# Altium project qol56-pcb.PrjPcb
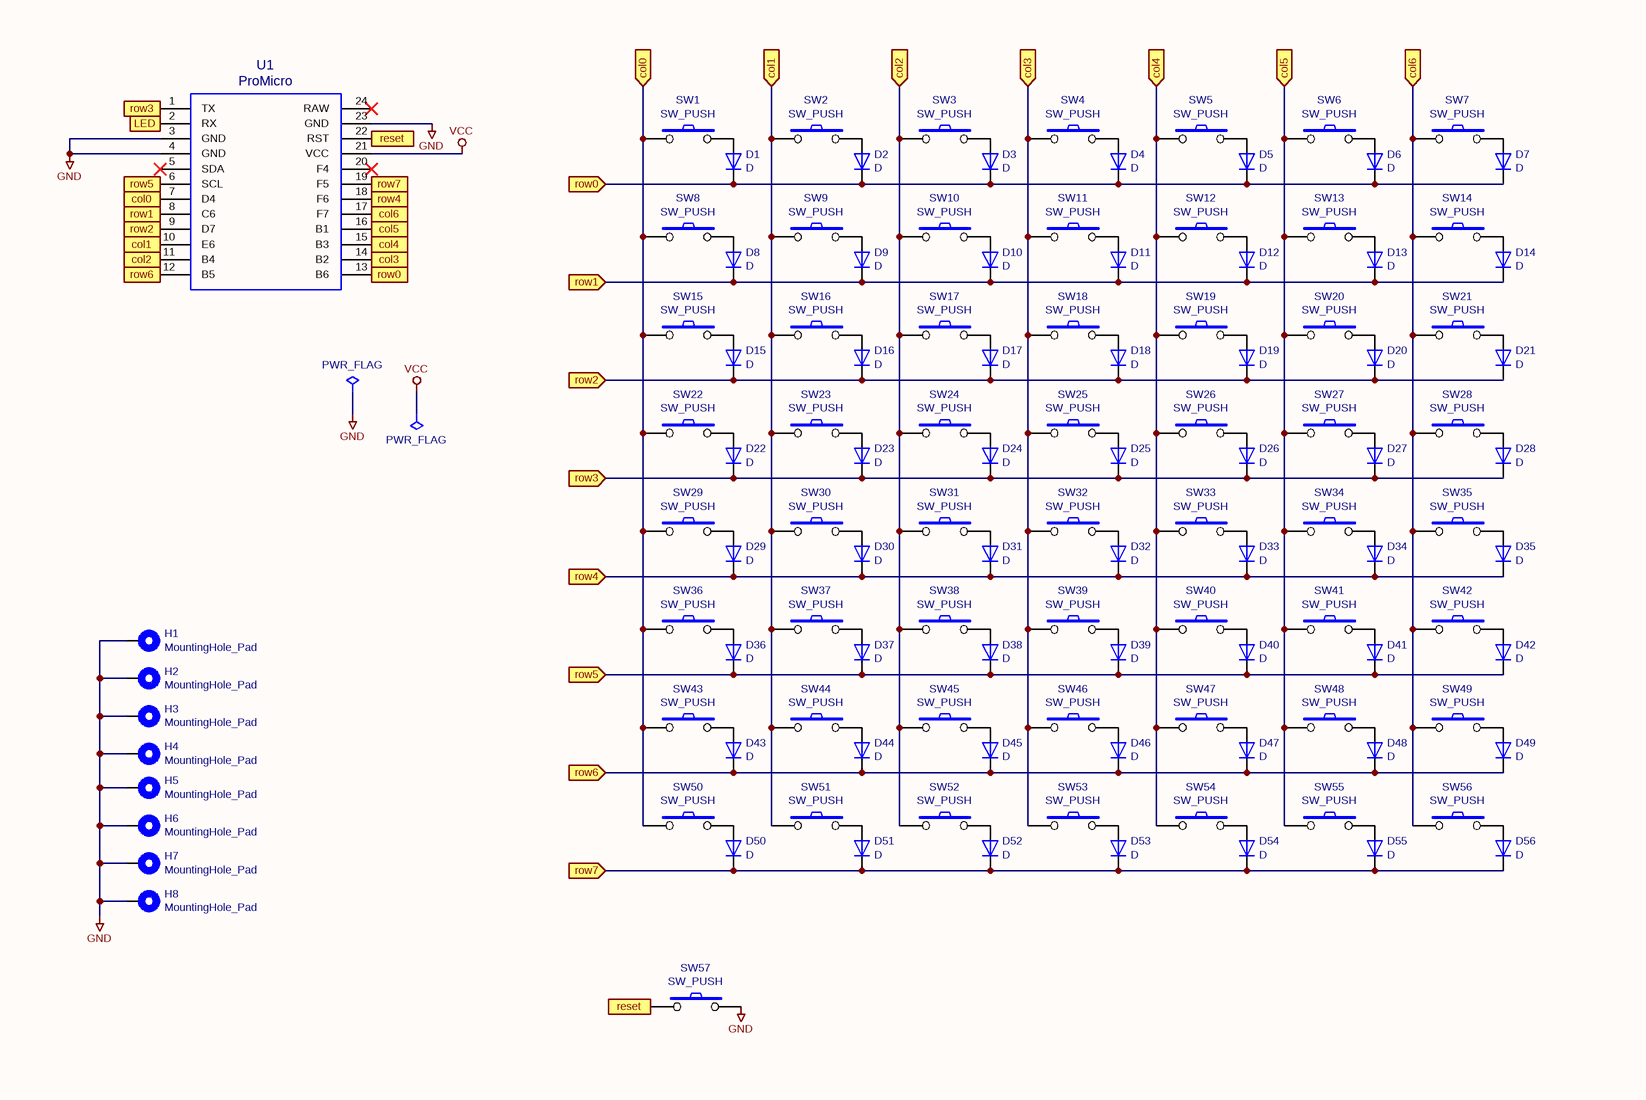
[diagram p0: qol56-pcb.SchDoc, left]
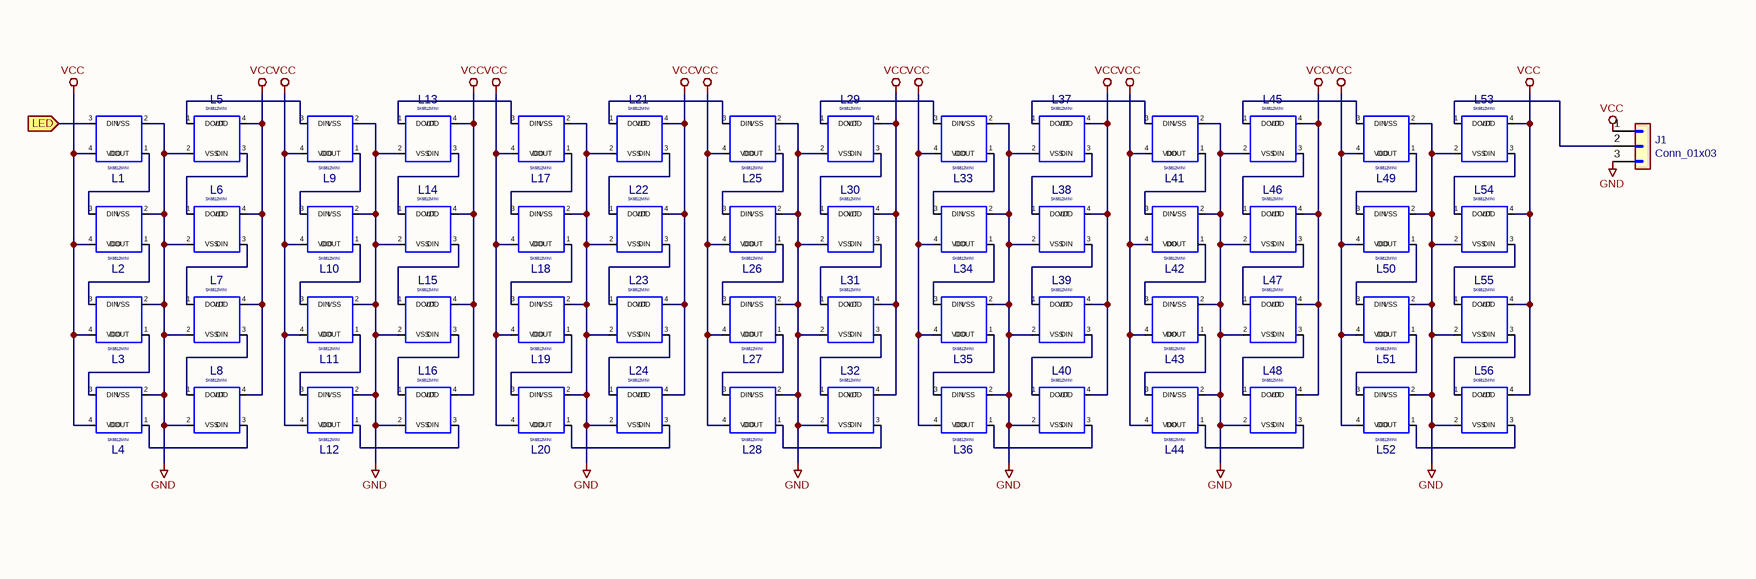
[diagram p1: qol56-pcb.SchDoc, right]
2 sheets, 189 parts. Net scope: flat (ports and power ports of the same name join across sheets).
Board files: qol56-pcb.PcbDoc, qol56-pcb(1).PcbDoc, qol56-top.PcbDoc, qol56-top(1).PcbDoc
Sheets:
  qol56-pcb.SchDoc
  qol56-top.SchDoc

## Sheet qol56-pcb.SchDoc
size 297 x 210 mm

### Parts
(Parts that share a designator on the sheet are numbered #1, #2 ... from top to bottom, then left to right.)
#FLG0101  PWR_FLAG  (graphical)
#FLG0102  PWR_FLAG  (graphical)
D1  D  [Diode-dual]
D2  D  [Diode-dual]
D3  D  [Diode-dual]
D4  D  [Diode-dual]
D5  D  [Diode-dual]
D6  D  [Diode-dual]
D7  D  [Diode-dual]
D8  D  [Diode-dual]
D9  D  [Diode-dual]
D10  D  [Diode-dual]
D11  D  [Diode-dual]
D12  D  [Diode-dual]
D13  D  [Diode-dual]
D14  D  [Diode-dual]
D15  D  [Diode-dual]
D16  D  [Diode-dual]
D17  D  [Diode-dual]
D18  D  [Diode-dual]
D19  D  [Diode-dual]
D20  D  [Diode-dual]
D21  D  [Diode-dual]
D22  D  [Diode-dual]
D23  D  [Diode-dual]
D24  D  [Diode-dual]
D25  D  [Diode-dual]
D26  D  [Diode-dual]
D27  D  [Diode-dual]
D28  D  [Diode-dual]
D29  D  [Diode-dual]
D30  D  [Diode-dual]
D31  D  [Diode-dual]
D32  D  [Diode-dual]
D33  D  [Diode-dual]
D34  D  [Diode-dual]
D35  D  [Diode-dual]
D36  D  [Diode-dual]
D37  D  [Diode-dual]
D38  D  [Diode-dual]
D39  D  [Diode-dual]
D40  D  [Diode-dual]
D41  D  [Diode-dual]
D42  D  [Diode-dual]
D43  D  [Diode-dual]
D44  D  [Diode-dual]
D45  D  [Diode-dual]
D46  D  [Diode-dual]
D47  D  [Diode-dual]
D48  D  [Diode-dual]
D49  D  [Diode-dual]
D50  D  [Diode-dual]
D51  D  [Diode-dual]
D52  D  [Diode-dual]
D53  D  [Diode-dual]
D54  D  [Diode-dual]
D55  D  [Diode-dual]
D56  D  [Diode-dual]
H1#1  MountingHole_Pad  [MountingHole_4mm_Pad]
H2#1  MountingHole_Pad  [MountingHole_4mm_Pad]
H3#1  MountingHole_Pad  [MountingHole_4mm_Pad]
H4#1  MountingHole_Pad  [MountingHole_4mm_Pad]
H5#1  MountingHole_Pad  [MountingHole_4mm_Pad]
H6#1  MountingHole_Pad  [MountingHole_4mm_Pad]
H7#1  MountingHole_Pad  [MountingHole_4mm_Pad]
H8#1  MountingHole_Pad  [MountingHole_4mm_Pad]
J1  Conn_01x03  [StripLED_rev]
L1  SK6812MINI  [SK6812MINI_rev]
L2  SK6812MINI  [SK6812MINI_rev]
L3  SK6812MINI  [SK6812MINI_rev]
L4  SK6812MINI  [SK6812MINI_rev]
L5  SK6812MINI  [SK6812MINI_rev]
L6  SK6812MINI  [SK6812MINI_rev]
L7  SK6812MINI  [SK6812MINI_rev]
L8  SK6812MINI  [SK6812MINI_rev]
L9  SK6812MINI  [SK6812MINI_rev]
L10  SK6812MINI  [SK6812MINI_rev]
L11  SK6812MINI  [SK6812MINI_rev]
L12  SK6812MINI  [SK6812MINI_rev]
L13  SK6812MINI  [SK6812MINI_rev]
L14  SK6812MINI  [SK6812MINI_rev]
L15  SK6812MINI  [SK6812MINI_rev]
L16  SK6812MINI  [SK6812MINI_rev]
L17  SK6812MINI  [SK6812MINI_rev]
L18  SK6812MINI  [SK6812MINI_rev]
L19  SK6812MINI  [SK6812MINI_rev]
L20  SK6812MINI  [SK6812MINI_rev]
L21  SK6812MINI  [SK6812MINI_rev]
L22  SK6812MINI  [SK6812MINI_rev]
L23  SK6812MINI  [SK6812MINI_rev]
L24  SK6812MINI  [SK6812MINI_rev]
L25  SK6812MINI  [SK6812MINI_rev]
L26  SK6812MINI  [SK6812MINI_rev]
L27  SK6812MINI  [SK6812MINI_rev]
L28  SK6812MINI  [SK6812MINI_rev]
L29  SK6812MINI  [SK6812MINI_rev]
L30  SK6812MINI  [SK6812MINI_rev]
L31  SK6812MINI  [SK6812MINI_rev]
L32  SK6812MINI  [SK6812MINI_rev]
L33  SK6812MINI  [SK6812MINI_rev]
L34  SK6812MINI  [SK6812MINI_rev]
L35  SK6812MINI  [SK6812MINI_rev]
L36  SK6812MINI  [SK6812MINI_rev]
L37  SK6812MINI  [SK6812MINI_rev]
L38  SK6812MINI  [SK6812MINI_rev]
L39  SK6812MINI  [SK6812MINI_rev]
L40  SK6812MINI  [SK6812MINI_rev]
L41  SK6812MINI  [SK6812MINI_rev]
L42  SK6812MINI  [SK6812MINI_rev]
L43  SK6812MINI  [SK6812MINI_rev]
L44  SK6812MINI  [SK6812MINI_rev]
L45  SK6812MINI  [SK6812MINI_rev]
L46  SK6812MINI  [SK6812MINI_rev]
L47  SK6812MINI  [SK6812MINI_rev]
L48  SK6812MINI  [SK6812MINI_rev]
L49  SK6812MINI  [SK6812MINI_rev]
L50  SK6812MINI  [SK6812MINI_rev]
L51  SK6812MINI  [SK6812MINI_rev]
L52  SK6812MINI  [SK6812MINI_rev]
L53  SK6812MINI  [SK6812MINI_rev]
L54  SK6812MINI  [SK6812MINI_rev]
L55  SK6812MINI  [SK6812MINI_rev]
L56  SK6812MINI  [SK6812MINI_rev]
SW1  SW_PUSH  [MX_PCB_100H]
SW2  SW_PUSH  [MX_PCB_100H]
SW3  SW_PUSH  [CherryMX_Hotswap]
SW4  SW_PUSH  [CherryMX_Hotswap]
SW5  SW_PUSH  [CherryMX_Hotswap]
SW6  SW_PUSH  [CherryMX_Hotswap]
SW7  SW_PUSH  [CherryMX_Hotswap]
SW8  SW_PUSH  [CherryMX_Hotswap]
SW9  SW_PUSH  [CherryMX_Hotswap]
SW10  SW_PUSH  [CherryMX_Hotswap]
SW11  SW_PUSH  [CherryMX_Hotswap]
SW12  SW_PUSH  [CherryMX_Hotswap]
SW13  SW_PUSH  [CherryMX_Hotswap]
SW14  SW_PUSH  [CherryMX_Hotswap]
SW15  SW_PUSH  [CherryMX_Hotswap]
SW16  SW_PUSH  [CherryMX_Hotswap]
SW17  SW_PUSH  [CherryMX_Hotswap]
SW18  SW_PUSH  [CherryMX_Hotswap]
SW19  SW_PUSH  [CherryMX_Hotswap]
SW20  SW_PUSH  [CherryMX_Hotswap]
SW21  SW_PUSH  [CherryMX_Hotswap]
SW22  SW_PUSH  [CherryMX_Hotswap]
SW23  SW_PUSH  [CherryMX_Hotswap]
SW24  SW_PUSH  [CherryMX_Hotswap]
SW25  SW_PUSH  [CherryMX_Hotswap]
SW26  SW_PUSH  [CherryMX_Hotswap]
SW27  SW_PUSH  [CherryMX_Hotswap]
SW28  SW_PUSH  [CherryMX_Hotswap]
SW29  SW_PUSH  [CherryMX_Hotswap]
SW30  SW_PUSH  [CherryMX_Hotswap]
SW31  SW_PUSH  [CherryMX_Hotswap]
SW32  SW_PUSH  [CherryMX_Hotswap]
SW33  SW_PUSH  [CherryMX_Hotswap]
SW34  SW_PUSH  [CherryMX_Hotswap]
SW35  SW_PUSH  [CherryMX_Hotswap]
SW36  SW_PUSH  [CherryMX_Hotswap]
SW37  SW_PUSH  [CherryMX_Hotswap]
SW38  SW_PUSH  [CherryMX_Hotswap]
SW39  SW_PUSH  [CherryMX_Hotswap]
SW40  SW_PUSH  [CherryMX_Hotswap]
SW41  SW_PUSH  [CherryMX_Hotswap]
SW42  SW_PUSH  [CherryMX_Hotswap]
SW43  SW_PUSH  [CherryMX_Hotswap]
SW44  SW_PUSH  [CherryMX_Hotswap]
SW45  SW_PUSH  [CherryMX_Hotswap]
SW46  SW_PUSH  [CherryMX_Hotswap]
SW47  SW_PUSH  [CherryMX_Hotswap]
SW48  SW_PUSH  [CherryMX_Hotswap]
SW49  SW_PUSH  [CherryMX_Hotswap]
SW50  SW_PUSH  [CherryMX_Hotswap]
SW51  SW_PUSH  [CherryMX_Hotswap]
SW52  SW_PUSH  [CherryMX_Hotswap]
SW53  SW_PUSH  [CherryMX_Hotswap]
SW54  SW_PUSH  [CherryMX_Hotswap]
SW55  SW_PUSH  [CherryMX_Hotswap]
SW56  SW_PUSH  [CherryMX_Hotswap]
SW57  SW_PUSH  [SMD 2Pin 3X4MM Tactile Tact Push Button]
U1  ProMicro  [ArduinoProMicro]

### Ports
col0 (in), col1 (in), col2 (in), col3 (in), col4 (in), col5 (in), col6 (in), LED (in), reset (in), row0 (in), row1 (in), row2 (in), row3 (in), row4 (in), row5 (in), row6 (in), row7 (in)

### Nets
GND: #FLG0101.1(pwr) H1#1.1 H2#1.1 H3#1.1 H4#1.1 H5#1.1 H6#1.1 H7#1.1 H8#1.1 J1.3(Pin_3) L1.2(VSS) L2.2(VSS) L3.2(VSS) L4.2(VSS) L5.2(VSS) L6.2(VSS) L7.2(VSS) L8.2(VSS) L9.2(VSS) L10.2(VSS) L11.2(VSS) L12.2(VSS) L13.2(VSS) L14.2(VSS) L15.2(VSS) L16.2(VSS) L17.2(VSS) L18.2(VSS) L19.2(VSS) L20.2(VSS) L21.2(VSS) L22.2(VSS) L23.2(VSS) L24.2(VSS) L25.2(VSS) L26.2(VSS) L27.2(VSS) L28.2(VSS) L29.2(VSS) L30.2(VSS) L31.2(VSS) L32.2(VSS) L33.2(VSS) L34.2(VSS) L35.2(VSS) L36.2(VSS) L37.2(VSS) L38.2(VSS) L39.2(VSS) L40.2(VSS) L41.2(VSS) L42.2(VSS) L43.2(VSS) L44.2(VSS) L45.2(VSS) L46.2(VSS) L47.2(VSS) L48.2(VSS) L49.2(VSS) L50.2(VSS) L51.2(VSS) L52.2(VSS) L53.2(VSS) L54.2(VSS) L55.2(VSS) L56.2(VSS) SW57.2 U1.3(GND) U1.4(GND) U1.23(GND)
VCC: #FLG0102.1(pwr) J1.1(Pin_1) L1.4(VDD) L2.4(VDD) L3.4(VDD) L4.4(VDD) L5.4(VDD) L6.4(VDD) L7.4(VDD) L8.4(VDD) L9.4(VDD) L10.4(VDD) L11.4(VDD) L12.4(VDD) L13.4(VDD) L14.4(VDD) L15.4(VDD) L16.4(VDD) L17.4(VDD) L18.4(VDD) L19.4(VDD) L20.4(VDD) L21.4(VDD) L22.4(VDD) L23.4(VDD) L24.4(VDD) L25.4(VDD) L26.4(VDD) L27.4(VDD) L28.4(VDD) L29.4(VDD) L30.4(VDD) L31.4(VDD) L32.4(VDD) L33.4(VDD) L34.4(VDD) L35.4(VDD) L36.4(VDD) L37.4(VDD) L38.4(VDD) L39.4(VDD) L40.4(VDD) L41.4(VDD) L42.4(VDD) L43.4(VDD) L44.4(VDD) L45.4(VDD) L46.4(VDD) L47.4(VDD) L48.4(VDD) L49.4(VDD) L50.4(VDD) L51.4(VDD) L52.4(VDD) L53.4(VDD) L54.4(VDD) L55.4(VDD) L56.4(VDD) U1.21(VCC)
col0: SW1.1 SW8.1 SW15.1 SW22.1 SW29.1 SW36.1 SW43.1 SW50.1 U1.7(D4) ; port col0
col1: SW2.1 SW9.1 SW16.1 SW23.1 SW30.1 SW37.1 SW44.1 SW51.1 U1.10(E6) ; port col1
col2: SW3.1 SW10.1 SW17.1 SW24.1 SW31.1 SW38.1 SW45.1 SW52.1 U1.11(B4) ; port col2
col3: SW4.1 SW11.1 SW18.1 SW25.1 SW32.1 SW39.1 SW46.1 SW53.1 U1.14(B2) ; port col3
col4: SW5.1 SW12.1 SW19.1 SW26.1 SW33.1 SW40.1 SW47.1 SW54.1 U1.15(B3) ; port col4
col5: SW6.1 SW13.1 SW20.1 SW27.1 SW34.1 SW41.1 SW48.1 SW55.1 U1.16(B1) ; port col5
col6: SW7.1 SW14.1 SW21.1 SW28.1 SW35.1 SW42.1 SW49.1 SW56.1 U1.17(F7) ; port col6
LED: L1.3(DIN) U1.2(RX) ; port LED
reset: SW57.1 U1.22(RST) ; port reset
row0: D1.1(K) D2.1(K) D3.1(K) D4.1(K) D5.1(K) D6.1(K) D7.1(K) U1.13(B6) ; port row0
row1: D8.1(K) D9.1(K) D10.1(K) D11.1(K) D12.1(K) D13.1(K) D14.1(K) U1.8(C6) ; port row1
row2: D15.1(K) D16.1(K) D17.1(K) D18.1(K) D19.1(K) D20.1(K) D21.1(K) U1.9(D7) ; port row2
row3: D22.1(K) D23.1(K) D24.1(K) D25.1(K) D26.1(K) D27.1(K) D28.1(K) U1.1(TX) ; port row3
row4: D29.1(K) D30.1(K) D31.1(K) D32.1(K) D33.1(K) D34.1(K) D35.1(K) U1.18(F6) ; port row4
row5: D36.1(K) D37.1(K) D38.1(K) D39.1(K) D40.1(K) D41.1(K) D42.1(K) U1.6(SCL) ; port row5
row6: D43.1(K) D44.1(K) D45.1(K) D46.1(K) D47.1(K) D48.1(K) D49.1(K) U1.12(B5) ; port row6
row7: D50.1(K) D51.1(K) D52.1(K) D53.1(K) D54.1(K) D55.1(K) D56.1(K) U1.19(F5) ; port row7
NetD1_2: D1.2(A) SW1.2
NetD2_2: D2.2(A) SW2.2
NetD3_2: D3.2(A) SW3.2
NetD4_2: D4.2(A) SW4.2
NetD5_2: D5.2(A) SW5.2
NetD6_2: D6.2(A) SW6.2
NetD7_2: D7.2(A) SW7.2
NetD8_2: D8.2(A) SW8.2
NetD9_2: D9.2(A) SW9.2
NetD10_2: D10.2(A) SW10.2
NetD11_2: D11.2(A) SW11.2
NetD12_2: D12.2(A) SW12.2
NetD13_2: D13.2(A) SW13.2
NetD14_2: D14.2(A) SW14.2
NetD15_2: D15.2(A) SW15.2
NetD16_2: D16.2(A) SW16.2
NetD17_2: D17.2(A) SW17.2
NetD18_2: D18.2(A) SW18.2
NetD19_2: D19.2(A) SW19.2
NetD20_2: D20.2(A) SW20.2
NetD21_2: D21.2(A) SW21.2
NetD22_2: D22.2(A) SW22.2
NetD23_2: D23.2(A) SW23.2
NetD24_2: D24.2(A) SW24.2
NetD25_2: D25.2(A) SW25.2
NetD26_2: D26.2(A) SW26.2
NetD27_2: D27.2(A) SW27.2
NetD28_2: D28.2(A) SW28.2
NetD29_2: D29.2(A) SW29.2
NetD30_2: D30.2(A) SW30.2
NetD31_2: D31.2(A) SW31.2
NetD32_2: D32.2(A) SW32.2
NetD33_2: D33.2(A) SW33.2
NetD34_2: D34.2(A) SW34.2
NetD35_2: D35.2(A) SW35.2
NetD36_2: D36.2(A) SW36.2
NetD37_2: D37.2(A) SW37.2
NetD38_2: D38.2(A) SW38.2
NetD39_2: D39.2(A) SW39.2
NetD40_2: D40.2(A) SW40.2
NetD41_2: D41.2(A) SW41.2
NetD42_2: D42.2(A) SW42.2
NetD43_2: D43.2(A) SW43.2
NetD44_2: D44.2(A) SW44.2
NetD45_2: D45.2(A) SW45.2
NetD46_2: D46.2(A) SW46.2
NetD47_2: D47.2(A) SW47.2
NetD48_2: D48.2(A) SW48.2
NetD49_2: D49.2(A) SW49.2
NetD50_2: D50.2(A) SW50.2
NetD51_2: D51.2(A) SW51.2
NetD52_2: D52.2(A) SW52.2
NetD53_2: D53.2(A) SW53.2
NetD54_2: D54.2(A) SW54.2
NetD55_2: D55.2(A) SW55.2
NetD56_2: D56.2(A) SW56.2
NetJ1_2: J1.2(Pin_2) L53.1(DOUT)
NetL1_1: L1.1(DOUT) L2.3(DIN)
NetL2_1: L2.1(DOUT) L3.3(DIN)
NetL3_1: L3.1(DOUT) L4.3(DIN)
NetL4_1: L4.1(DOUT) L8.3(DIN)
NetL5_1: L5.1(DOUT) L9.3(DIN)
NetL5_3: L5.3(DIN) L6.1(DOUT)
NetL6_3: L6.3(DIN) L7.1(DOUT)
NetL7_3: L7.3(DIN) L8.1(DOUT)
NetL9_1: L9.1(DOUT) L10.3(DIN)
NetL10_1: L10.1(DOUT) L11.3(DIN)
NetL11_1: L11.1(DOUT) L12.3(DIN)
NetL12_1: L12.1(DOUT) L16.3(DIN)
NetL13_1: L13.1(DOUT) L17.3(DIN)
NetL13_3: L13.3(DIN) L14.1(DOUT)
NetL14_3: L14.3(DIN) L15.1(DOUT)
NetL15_3: L15.3(DIN) L16.1(DOUT)
NetL17_1: L17.1(DOUT) L18.3(DIN)
NetL18_1: L18.1(DOUT) L19.3(DIN)
NetL19_1: L19.1(DOUT) L20.3(DIN)
NetL20_1: L20.1(DOUT) L24.3(DIN)
NetL21_1: L21.1(DOUT) L25.3(DIN)
NetL21_3: L21.3(DIN) L22.1(DOUT)
NetL22_3: L22.3(DIN) L23.1(DOUT)
NetL23_3: L23.3(DIN) L24.1(DOUT)
NetL25_1: L25.1(DOUT) L26.3(DIN)
NetL26_1: L26.1(DOUT) L27.3(DIN)
NetL27_1: L27.1(DOUT) L28.3(DIN)
NetL28_1: L28.1(DOUT) L32.3(DIN)
NetL29_1: L29.1(DOUT) L33.3(DIN)
NetL29_3: L29.3(DIN) L30.1(DOUT)
NetL30_3: L30.3(DIN) L31.1(DOUT)
NetL31_3: L31.3(DIN) L32.1(DOUT)
NetL33_1: L33.1(DOUT) L34.3(DIN)
NetL34_1: L34.1(DOUT) L35.3(DIN)
NetL35_1: L35.1(DOUT) L36.3(DIN)
NetL36_1: L36.1(DOUT) L40.3(DIN)
NetL37_1: L37.1(DOUT) L41.3(DIN)
NetL37_3: L37.3(DIN) L38.1(DOUT)
NetL38_3: L38.3(DIN) L39.1(DOUT)
NetL39_3: L39.3(DIN) L40.1(DOUT)
NetL41_1: L41.1(DOUT) L42.3(DIN)
NetL42_1: L42.1(DOUT) L43.3(DIN)
NetL43_1: L43.1(DOUT) L44.3(DIN)
NetL44_1: L44.1(DOUT) L48.3(DIN)
NetL45_1: L45.1(DOUT) L49.3(DIN)
NetL45_3: L45.3(DIN) L46.1(DOUT)
NetL46_3: L46.3(DIN) L47.1(DOUT)
NetL47_3: L47.3(DIN) L48.1(DOUT)
NetL49_1: L49.1(DOUT) L50.3(DIN)
NetL50_1: L50.1(DOUT) L51.3(DIN)
NetL51_1: L51.1(DOUT) L52.3(DIN)
NetL52_1: L52.1(DOUT) L56.3(DIN)
NetL53_3: L53.3(DIN) L54.1(DOUT)
NetL54_3: L54.3(DIN) L55.1(DOUT)
NetL55_3: L55.3(DIN) L56.1(DOUT)

Not connected (* = marked no-connect by the designer): U1 5(SDA)* 20(F4)* 24(RAW)*

### Notes on the sheet
- 1
- 2
- 3
- 4
- 5
- 6
- A
- B
- C
- D
- Title:
- File: qol56-pcb.sch
- Sheet: /
- KiCad E.D.A.  kicad (5.1.4)-1
- Size: A4
- Date:
- Rev:
- Id: 1/1

### Library data of the parts
#FLG0101 #FLG0102 = PWR_FLAG: Value: PWR_FLAG
D1-D56 = D: Value: D; Footprint: eswai:Diode-dual
H1#1 H2#1 H3#1 H4#1 H5#1 H6#1 H7#1 H8#1 = MountingHole_Pad: Value: MountingHole_Pad; Footprint: MountingHole:MountingHole_4mm_Pad
J1 = Conn_01x03: Value: Conn_01x03; Footprint: eswai:StripLED_rev
L1-L56 = SK6812MINI: Value: SK6812MINI; Footprint: eswai:SK6812MINI_rev
SW1-SW57 = SW_PUSH: Value: SW_PUSH
  SW1 SW2: Footprint: eswai:MX_PCB_100H
  SW3-SW56: Footprint: eswai:CherryMX_Hotswap
  SW57: Footprint: eswai:SMD 2Pin 3X4MM Tactile Tact Push Button
U1 = ProMicro: Value: ProMicro; Footprint: eswai:ArduinoProMicro

## Sheet qol56-top.SchDoc
size 297 x 210 mm
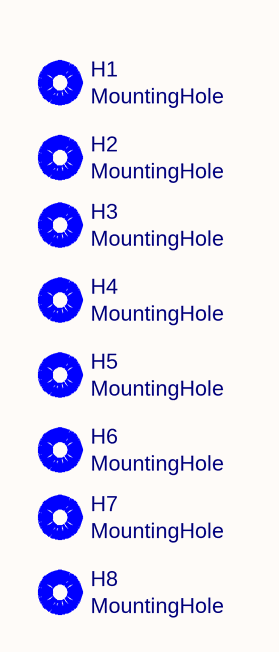
[diagram p2: qol56-top.SchDoc]

### Parts
(Parts that share a designator on the sheet are numbered #1, #2 ... from top to bottom, then left to right.)
H1#2  MountingHole  [MountingHole_2.2mm_M2]
H2#2  MountingHole  [MountingHole_2.2mm_M2]
H3#2  MountingHole  [MountingHole_2.2mm_M2]
H4#2  MountingHole  [MountingHole_2.2mm_M2]
H5#2  MountingHole  [MountingHole_2.2mm_M2]
H6#2  MountingHole  [MountingHole_2.2mm_M2]
H7#2  MountingHole  [MountingHole_2.2mm_M2]
H8#2  MountingHole  [MountingHole_2.2mm_M2]

### Notes on the sheet
- 1
- 2
- 3
- 4
- 5
- 6
- A
- B
- C
- D
- Title:
- File: qol56-top.sch
- Sheet: /
- KiCad E.D.A.  kicad (5.1.4)-1
- Size: A4
- Date:
- Rev:
- Id: 1/1

### Library data of the parts
H1#2 H2#2 H3#2 H4#2 H5#2 H6#2 H7#2 H8#2 = MountingHole: Value: MountingHole; Footprint: MountingHole:MountingHole_2.2mm_M2